# EAGLE design motor_encoder (EAGLE 9.6.2)
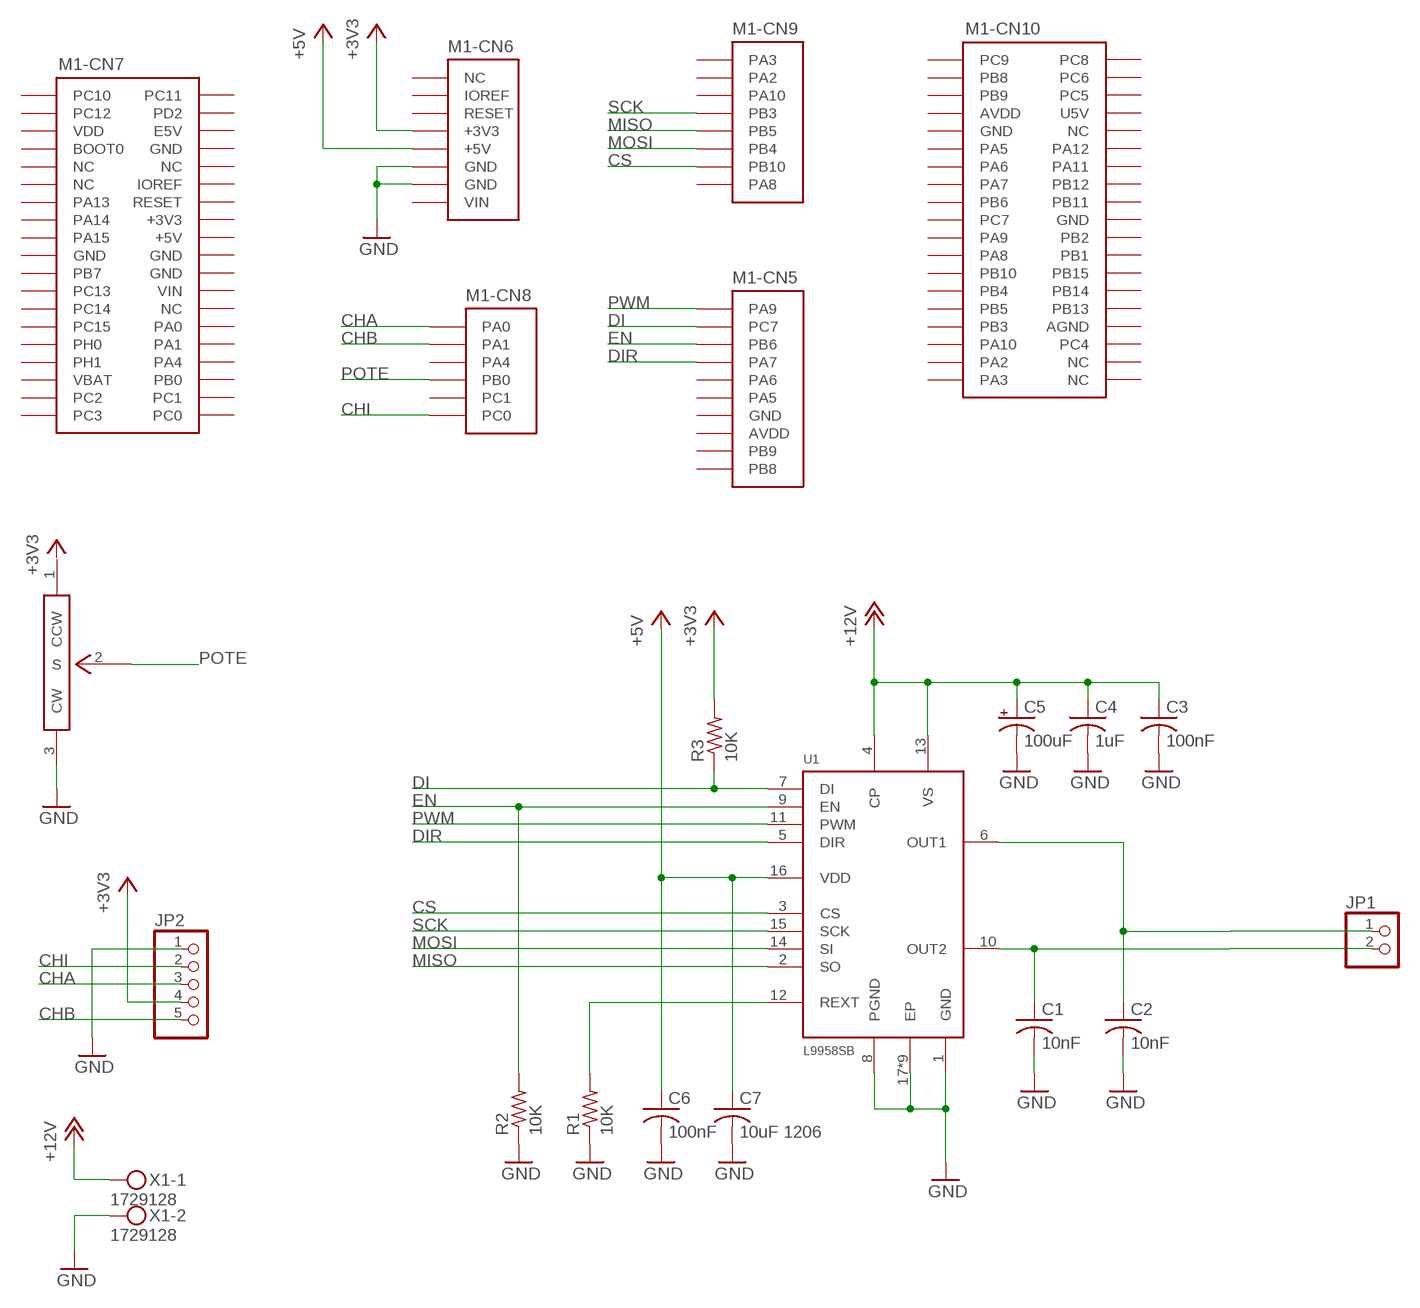
[diagram p0: schematic, sheet 1]

## Parts
C1  10nF  C-USC0805  [C0805]
C2  10nF  C-USC0805  [C0805]
C3  100nF  C-USC0805  [C0805]
C4  1uF  C-USC0805  [C0805]
C5  100uF  CPOL-US  [F80-UNITE_CHEMI-CON]
C6  100nF  C-USC0805  [C0805]
C7  10uF 1206  C-USC1206  [C1206]
JP1  PINHD-1X2  [1X02]
JP2  PINHD-1X5  [1X05]
M1  NUCLEO-L452RE  [NUCLEO-64]
R1  10K  R-US_R0805  [R0805]
R2  10K  R-US_R0805  [R0805]
R3  10K  R-US_R0805  [R0805]
U1  L9958SB  [POWERSO-16]
VR1  P160KN-0QD15B10K  P160KN  [P160KN-0QD15B10K]
X1  1729128  MKDSN1,5/2-5,08  [MKDSN1,5/2-5,08]

## Nets
+3V3: JP2.4 M1.CN6-4(-CN6:+3V3) R3.2
+5V: C6.1 C7.1 M1.CN6-5(-CN6:+5V) U1.16(VDD)
+12V: C3.1 C4.1 C5.1(+) U1.4(CP) U1.13(VS) X1.1
CHA: JP2.3 M1.CN8-1(-CN8:PA0)
CHB: JP2.5 M1.CN8-2(-CN8:PA1)
CHI: JP2.2 M1.CN8-6(-CN8:PC0)
CS: M1.CN9-7(-CN9:PB10) U1.3(CS)
DI: M1.CN5-2(-CN5:PC7) R3.1 U1.7(DI)
DIR: M1.CN5-4(-CN5:PA7) U1.5(DIR)
EN: M1.CN5-3(-CN5:PB6) R2.2 U1.9(EN)
GND: C1.2 C2.2 C3.2 C4.2 C5.2(-) C6.2 C7.2 JP2.1 M1.CN6-6(-CN6:GND) M1.CN6-7(-CN6:GND) R1.1 R2.1 U1.1(GND) U1.8(PGND) U1.17(EP) U1.18(EP) U1.19(EP) U1.20(EP) U1.21(EP) U1.22(EP) U1.23(EP) U1.24(EP) U1.25(EP) VR1.3(CW) X1.2
MISO: M1.CN9-5(-CN9:PB5) U1.2(SO)
MOSI: M1.CN9-6(-CN9:PB4) U1.14(SI)
N$1: C1.1 JP1.2 U1.10(OUT2)
N$2: C2.1 JP1.1 U1.6(OUT1)
N$3: R1.2 U1.12(REXT)
POTE: M1.CN8-4(-CN8:PB0) VR1.2(S)
PWM: M1.CN5-1(-CN5:PA9) U1.11(PWM)
SCK: M1.CN9-4(-CN9:PB3) U1.15(SCK)
Unconnected: M1.CN5-5(-CN5:PA6) M1.CN5-6(-CN5:PA5) M1.CN5-9(-CN5:PB9) M1.CN5-10(-CN5:PB8) M1.CN6-1(-CN6:NC) M1.CN6-3(-CN6:RESET) M1.CN7-1(-CN7:PC10) M1.CN7-2(-CN7:PC11) M1.CN7-3(-CN7:PC12) M1.CN7-4(-CN7:PD2) M1.CN7-6(-CN7:E5V) M1.CN7-7(-CN7:BOOT0) M1.CN7-9(-CN7:NC) M1.CN7-10(-CN7:NC) M1.CN7-11(-CN7:NC) M1.CN7-12(-CN7:IOREF) M1.CN7-13(-CN7:PA13) M1.CN7-14(-CN7:RESET) M1.CN7-15(-CN7:PA14) M1.CN7-17(-CN7:PA15) M1.CN7-21(-CN7:PB7) M1.CN7-23(-CN7:PC13) M1.CN7-25(-CN7:PC14) M1.CN7-26(-CN7:NC) M1.CN7-27(-CN7:PC15) M1.CN7-28(-CN7:PA0) M1.CN7-29(-CN7:PH0) M1.CN7-30(-CN7:PA1) M1.CN7-31(-CN7:PH1) M1.CN7-32(-CN7:PA4) M1.CN7-34(-CN7:PB0) M1.CN7-35(-CN7:PC2) M1.CN7-36(-CN7:PC1) M1.CN7-37(-CN7:PC3) M1.CN7-38(-CN7:PC0) M1.CN8-3(-CN8:PA4) M1.CN8-5(-CN8:PC1) M1.CN9-1(-CN9:PA3) M1.CN9-2(-CN9:PA2) M1.CN9-3(-CN9:PA10) M1.CN9-8(-CN9:PA8) M1.CN10-1(-CN10:PC9) M1.CN10-2(-CN10:PC8) M1.CN10-3(-CN10:PB8) M1.CN10-4(-CN10:PC6) M1.CN10-5(-CN10:PB9) M1.CN10-6(-CN10:PC5) M1.CN10-10(-CN10:NC) M1.CN10-11(-CN10:PA5) M1.CN10-12(-CN10:PA12) M1.CN10-13(-CN10:PA6) M1.CN10-14(-CN10:PA11) M1.CN10-15(-CN10:PA7) M1.CN10-16(-CN10:PB12) M1.CN10-17(-CN10:PB6) M1.CN10-18(-CN10:PB11) M1.CN10-19(-CN10:PC7) M1.CN10-21(-CN10:PA9) M1.CN10-22(-CN10:PB2) M1.CN10-23(-CN10:PA8) M1.CN10-24(-CN10:PB1) M1.CN10-25(-CN10:PB10) M1.CN10-26(-CN10:PB15) M1.CN10-27(-CN10:PB4) M1.CN10-28(-CN10:PB14) M1.CN10-29(-CN10:PB5) M1.CN10-30(-CN10:PB13) M1.CN10-31(-CN10:PB3) M1.CN10-33(-CN10:PA10) M1.CN10-34(-CN10:PC4) M1.CN10-35(-CN10:PA2) M1.CN10-36(-CN10:NC) M1.CN10-37(-CN10:PA3) M1.CN10-38(-CN10:NC) VR1.1(CCW)

## Power pins joined to a net without a drawn wire
+3V3: M1.CN7-16(-CN7:+3V3)
+5V: M1.CN7-18(-CN7:+5V)
AGND: M1.CN10-32(-CN10:AGND)
AVDD: M1.CN5-8(-CN5:AVDD) M1.CN10-7(-CN10:AVDD)
GND: M1.CN5-7(-CN5:GND) M1.CN7-8(-CN7:GND) M1.CN7-19(-CN7:GND) M1.CN7-20(-CN7:GND) M1.CN7-22(-CN7:GND) M1.CN10-9(-CN10:GND) M1.CN10-20(-CN10:GND)
IOREF: M1.CN6-2(-CN6:IOREF)
U5V: M1.CN10-8(-CN10:U5V)
VBAT: M1.CN7-33(-CN7:VBAT)
VDD: M1.CN7-5(-CN7:VDD)
VIN: M1.CN6-8(-CN6:VIN) M1.CN7-24(-CN7:VIN)

## Library data of the parts
C1 C2 = rcl:C-US: CAPACITOR, American symbol; PARTNO: GRM2195C1H103JA01D; SPICEPREFIX: C
C3 C6 = rcl:C-US: CAPACITOR, American symbol; PARTNO: GCM21BR72A104KA37L; SPICEPREFIX: C
C4 = rcl:C-US: CAPACITOR, American symbol; PARTNO: GCJ219R71C105KA01D; SPICEPREFIX: C
C5 = rcl_v2:CPOL-US: POLARIZED CAPACITOR, American symbol; PARTNO: EMVE250ADA101MF80G
C7 = rcl:C-US: CAPACITOR, American symbol; SPICEPREFIX: C
JP1 = pinhead:PINHD-1X2: PIN HEADER
JP2 = pinhead:PINHD-1X5: PIN HEADER
M1 = NUCLEO-L452RE:NUCLEO-L452RE: No existe un outline (Layer Dimension) para esta librería. En su lugar se utilizó una referencia en tDocu. Al momento de diseñar la tarjeta, el Dimension debe ser dibujado según los requerimientos del usuario, o simplemente copiar los contenidos del tDocu en Dimensions.
R1-R3 = rcl:R-US_: RESISTOR, American symbol; PARTNO: RC0805FR-0710KL; SPICEPREFIX: R
U1 = L9958SBTR:L9958SB; PARTNO: L9958SB
VR1 = P160KN:P160KN; PARTNO: P160KN-0QD15B10K
X1 = 1729128 - PHOENIX CONTACT:MKDSN1,5/2-5,08: MKDSN 1,5/ 2-5,08 Printklemme Nennstrom: 13,5 A Nennspannung: 250 V Rastermaß: 5,08 mm Polzahl: 2 Anschlussart: Schraubanschluss Montage: Löten Anschlussrichtung Leiter/Platine: 0 ° Artikelnummer: 1729128 Source: http://eshop.phoenixcontact.com .. 1729128.pdf; PARTNO: 1729128

## Board
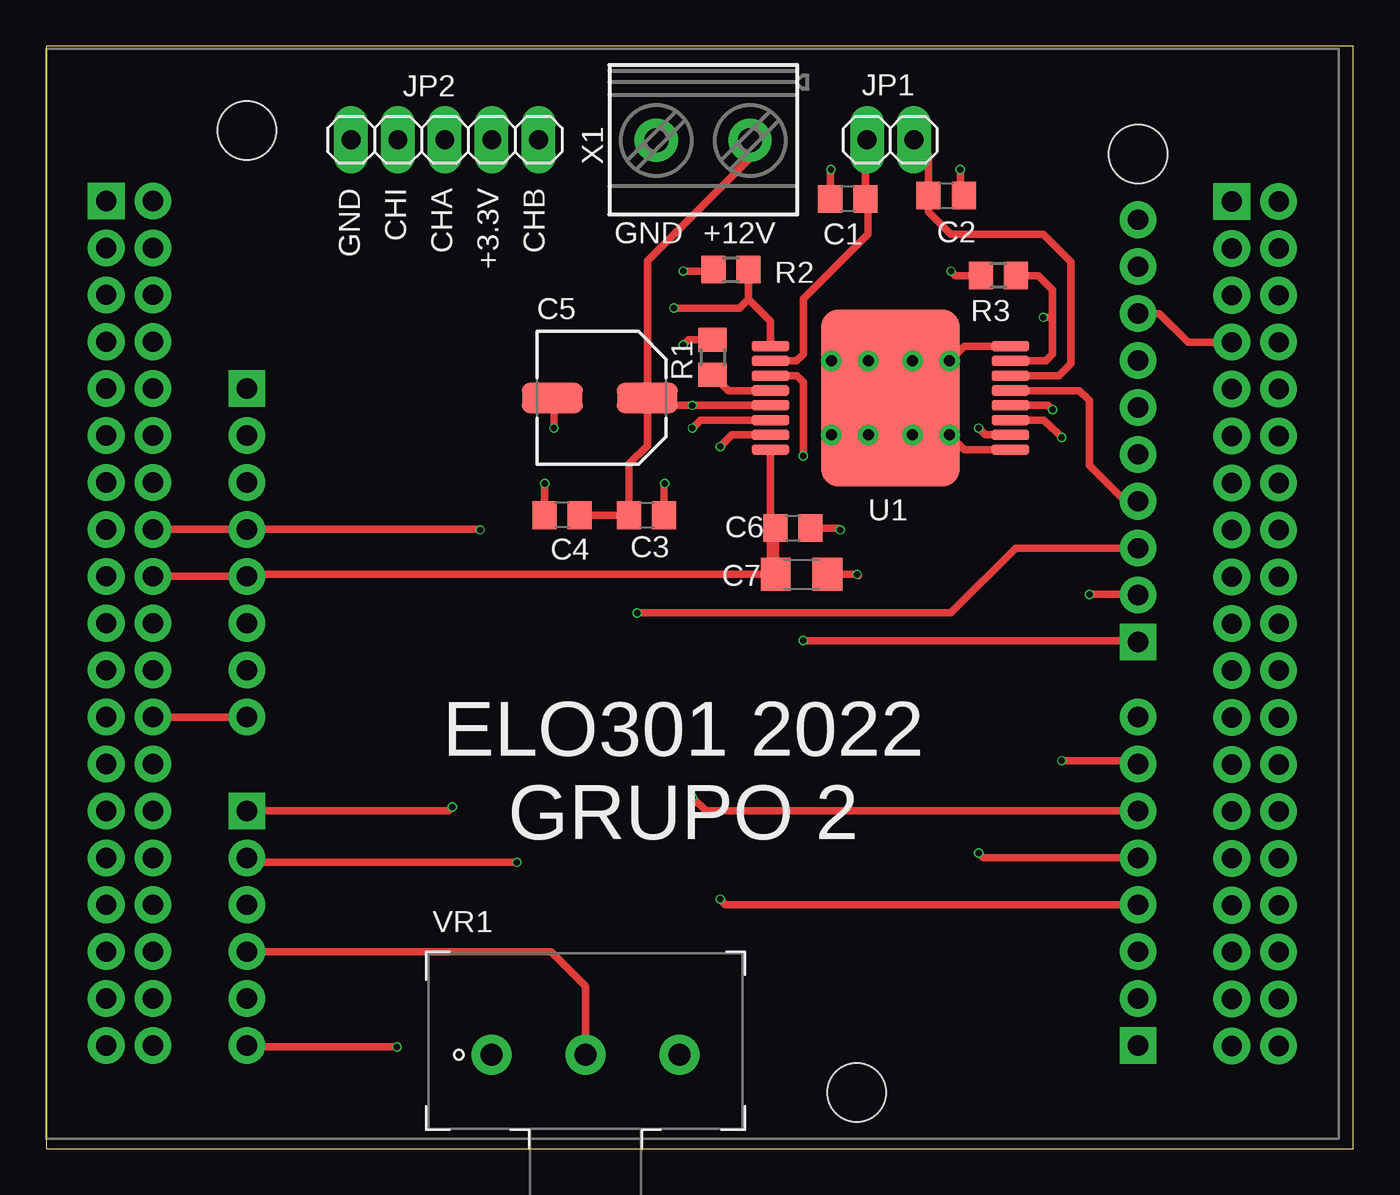
[diagram p1: board, top side]
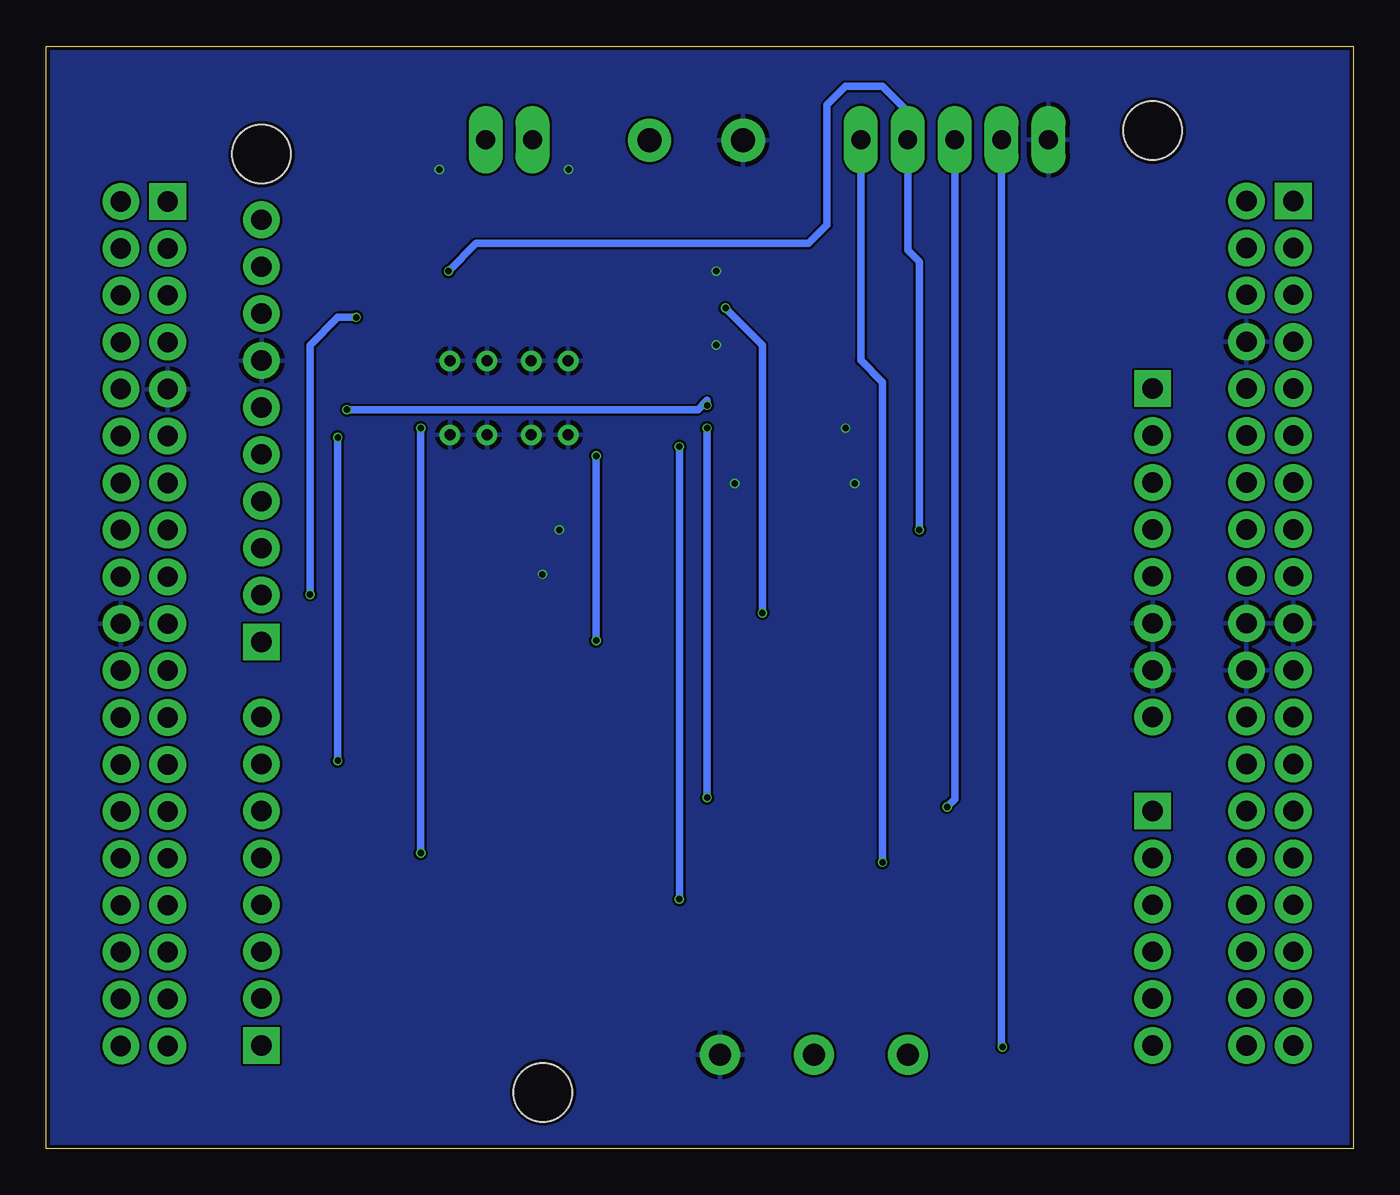
[diagram p2: board, bottom side, seen from below]

Size 70.79 x 59.68 mm. Coordinates in mm from the lower left corner, seen from the top.
Outline: 0,0 70.79,0 70.79,59.68 0,59.68 0,0
Copper layers (1*16): Top 0.035mm / dielectric 1.6mm / Bottom 0.035mm
Design rules "jlcpcb-2layers *": minimum track width 5mil, minimum drill 0.3mm, track to track 5mil, track to pad 5mil, pad to pad 5mil, via to via 5mil, smd to smd 5mil, copper to edge 0.2mm, drill to drill 6mil, minimum pad ring 10mil, minimum via ring 3mil, stop-mask expansion 4mil, vias tented up to drill 15mil, thermal gap 10mil

### Footprints (pad centres in the part's own frame; a part is rotated, then mirrored left to right if it is on the bottom)
C0805 = smd 1.3 x 1.5: 1 -0.95,0; 2 0.95,0
F80-UNITE_CHEMI-CON = smd 3.3 x 1.65: 1 -2.575,0; 2 2.575,0
C1206 = smd 1.6 x 1.8: 1 -1.4,0; 2 1.4,0
1X02 = drill 1.016 long: 1 -1.27,0; 2 1.27,0
1X05 = drill 1.016 long: 1 -5.08,0; 2 -2.54,0; 3 0,0; 4 2.54,0; 5 5.08,0
NUCLEO-64 = drill 1.1 pad 1.85 square: CN5-1 59.13,24.884; CN6-1 10.87,38.6; CN7-1 3.25,48.76; CN8-1 10.87,15.74; CN9-1 59.13,3.04; CN10-1 64.21,48.735 | drill 1.1 pad 1.85: CN5-2 59.13,27.424; CN5-3 59.13,29.964; CN5-4 59.13,32.504; CN5-5 59.13,35.044; CN5-6 59.13,37.584; CN5-7 59.13,40.124; CN5-8 59.13,42.664; CN5-9 59.13,45.204; CN5-10 59.13,47.744; CN6-2 10.87,36.06; CN6-3 10.87,33.52; CN6-4 10.87,30.98; CN6-5 10.87,28.44; CN6-6 10.87,25.9; CN6-7 10.87,23.36; CN6-8 10.87,20.82; CN7-2 5.79,48.76; CN7-3 3.25,46.22; CN7-4 5.79,46.22; CN7-5 3.25,43.68; CN7-6 5.79,43.68; CN7-7 3.25,41.14; CN7-8 5.79,41.14; CN7-9 3.25,38.6; CN7-10 5.79,38.6; CN7-11 3.25,36.06; CN7-12 5.79,36.06; CN7-13 3.25,33.52; CN7-14 5.79,33.52; CN7-15 3.25,30.98; CN7-16 5.79,30.98; CN7-17 3.25,28.44; CN7-18 5.79,28.44; CN7-19 3.25,25.9; CN7-20 5.79,25.9; CN7-21 3.25,23.36; CN7-22 5.79,23.36; CN7-23 3.25,20.82; CN7-24 5.79,20.82; CN7-25 3.25,18.28; CN7-26 5.79,18.28; CN7-27 3.25,15.74; CN7-28 5.79,15.74; CN7-29 3.25,13.2; CN7-30 5.79,13.2; CN7-31 3.25,10.66; CN7-32 5.79,10.66; CN7-33 3.25,8.12; CN7-34 5.79,8.12; CN7-35 3.25,5.58; CN7-36 5.79,5.58; CN7-37 3.25,3.04; CN7-38 5.79,3.04; CN8-2 10.87,13.2; CN8-3 10.87,10.66; CN8-4 10.87,8.12; CN8-5 10.87,5.58; CN8-6 10.87,3.04; CN9-2 59.13,5.58; CN9-3 59.13,8.12; CN9-4 59.13,10.66; CN9-5 59.13,13.2; CN9-6 59.13,15.74; CN9-7 59.13,18.28; CN9-8 59.13,20.82; CN10-2 66.75,48.735; CN10-3 64.21,46.195; CN10-4 66.75,46.195; CN10-5 64.21,43.655; CN10-6 66.75,43.655; CN10-7 64.21,41.115; CN10-8 66.75,41.115; CN10-9 64.21,38.575; CN10-10 66.75,38.575; CN10-11 64.21,36.035; CN10-12 66.75,36.035; CN10-13 64.21,33.495; CN10-14 66.75,33.495; CN10-15 64.21,30.955; CN10-16 66.75,30.955; CN10-17 64.21,28.415; CN10-18 66.75,28.415; CN10-19 64.21,25.875; CN10-20 66.75,25.875; CN10-21 64.21,23.335; CN10-22 66.75,23.335; CN10-23 64.21,20.795; CN10-24 66.75,20.795; CN10-25 64.21,18.255; CN10-26 66.75,18.255; CN10-27 64.21,15.715; CN10-28 66.75,15.715; CN10-29 64.21,13.175; CN10-30 66.75,13.175; CN10-31 64.21,10.635; CN10-32 66.75,10.635; CN10-33 64.21,8.095; CN10-34 66.75,8.095; CN10-35 64.21,5.555; CN10-36 66.75,5.555; CN10-37 64.21,3.015; CN10-38 66.75,3.015 | hole 3.175: 59.13,51.3; 10.87,52.57; 43.89,0.5
R0805 = smd 1.3 x 1.5: 1 -0.95,0; 2 0.95,0
POWERSO-16 = smd 2.05 x 0.55: 1 -6.5,2.8; 2 -6.5,2; 3 -6.5,1.2; 4 -6.5,0.4; 5 -6.5,-0.4; 6 -6.5,-1.2; 7 -6.5,-2; 8 -6.5,-2.8; 9 6.5,-2.8; 10 6.5,-2; 11 6.5,-1.2; 12 6.5,-0.4; 13 6.5,0.4; 14 6.5,1.2; 15 6.5,2; 16 6.5,2.8 | drill 0.6: 17 -1.2,2; 18 1.2,2; 19 1.2,-2; 20 -1.2,-2; 21 -3.2,-2; 22 3.2,-2; 23 3.2,2; 24 -3.2,2 | smd 7.5 x 9.6: 25 0,0
P160KN-0QD15B10K = drill 1.2: 1 0,-5.08; 2 0,0; 3 0,5.08
MKDSN1,5/2-5,08 = drill 1.3 pad 2: 1 -2.561,0.025; 2 2.519,0.025

### Placement (x,y rotation side)
C1  43.41,51.41 180 top
C2  48.74,51.59 0 top
C3  32.52,34.29 0 top
C4  27.94,34.29 180 top
C5  29.98,40.64 180 top
C6  40.44,33.59 0 top
C7  40.91,31.09 0 top
JP1  45.72,54.61 180 top
JP2  21.59,54.61 0 top
M1  0,2.54 0 top
R1  36.09,42.84 270 top
R2  37.08,47.59 0 top
R3  51.57,47.26 180 top
U1  45.72,40.64 180 top
VR1  29.21,5.08 270 top
X1  35.56,54.61 180 top

### Tracks (layer width: path | path; a pad name or v marks a point on that pad's centre or on a via)
+3V3  (via drill 0.35)
  Top 0.4: M1.CN7-16 M1.CN6-4 23.48,33.52 v23.5,33.5 | R3.2 49.24,47.26 v49,47.5
  Bottom 0.4: v23.5,33.5 23.5,48 24.13,48.63 24.13,54.5 JP2.4 24.13,56.13 25.5,57.5 27.5,57.5 28.5,56.5 28.5,50 29.5,49 47.5,49 v49,47.5
+5V
  Top 0.4: C7.1 39.22,31.38 U1.16 | C7.1 10.98,31.09 M1.CN6-5 M1.CN7-18 | C6.1 39.49,31.11 C7.1
+12V  (via drill 0.35)
  Top 0.4: U1.13 v35,40.24 32.95,40.24 C5.1 | C5.1 32.55,48.05 38.12,53.62 X1.1 | C4.1 C3.1 31.57,37.07 32.55,38.05 C5.1 | U1.4 54.26,40.24 v54.5,40
  Bottom 0.4: v54.5,40 35.5,40 35,40.5 v35,40.24
AVDD
  Top 0.4: M1.CN5-8 60.3,45.2 61.84,43.66 M1.CN10-7
CHA  (via drill 0.35)
  Top 0.4: v22,18.5 21.78,18.28 M1.CN8-1
  Bottom 0.4: JP2.3 21.59,18.91 v22,18.5
CHB  (via drill 0.35)
  Top 0.4: v25.5,15.5 11.11,15.5 M1.CN8-2
  Bottom 0.4: JP2.5 26.67,42.67 25.5,41.5 v25.5,15.5
CHI  (via drill 0.35)
  Top 0.4: v19,5.5 10.95,5.5 M1.CN8-6
  Bottom 0.4: JP2.2 19.05,5.55 v19,5.5
CS  (via drill 0.35)
  Top 0.4: U1.3 54.03,39.44 54.2,39.27 54.23,39.27 v55,38.5 | v55,21 58.95,21 M1.CN9-7
  Bottom 0.4: v55,38.5 v55,21
DI  (via drill 0.35)
  Top 0.4: U1.7 54.14,42.64 54.5,43 54.5,45 | R3.1 53.74,47.26 54.5,46.5 54.5,45 | 54.5,45 v54,45 | v56.5,30 59.09,30 M1.CN5-2
  Bottom 0.4: v54,45 55,45 56.5,43.5 v56.5,30
DIR
  Top 0.4: U1.5 55.96,41.04 56.5,40.5 56.5,37 58.46,35.04 M1.CN5-4
EN  (via drill 0.35)
  Top 0.4: U1.9 39.22,44.78 38.03,45.97 | 38.03,45.97 R2.2 | M1.CN5-3 52.5,32.5 49,29 v32,29 | v34,45.5 37.56,45.5 38.03,45.97
  Bottom 0.4: v32,29 32,43.5 v34,45.5
GND  (via drill 0.35)
  Top 0.4: C5.2 27.5,40.55 v27.5,39 | C4.2 v26.99,35.99 v27,36 | C3.2 33.47,35.97 v33.5,36 | C6.2 42.91,33.59 v43,33.5 | C7.2 v43.91,31.09 44,31 | R2.1 36.04,47.5 v34.5,47.5 | R1.1 34.79,43.79 v34.5,43.5 | U1.8 49.72,43.44 U1.21 | C1.2 42.46,52.96 v42.5,53 | C2.2 49.5,51.78 v49.5,53 | U1.1 49.72,37.84 U1.24 | U1.25 44.52,41.84 U1.19
  pour Bottom: 0,0 71,0 71,27.5 71,59.5 40,59.5 0,59.5
MISO  (via drill 0.35)
  Top 0.4: U1.2 50.86,38.64 v50.5,39 | v50.5,16 50.76,15.74 M1.CN9-5
  Bottom 0.4: v50.5,39 v50.5,16
MOSI  (via drill 0.35)
  Top 0.4: U1.14 35.44,39.44 v35,39 | v35,19 35.72,18.28 M1.CN9-6
  Bottom 0.4: v35,39 v35,19
N$1
  Top 0.4: U1.10 40.64,42.64 41,43 41,46 44.5,49.5 44.5,51.27 C1.1 44.36,54.52 JP1.2
N$2
  Top 0.4: JP1.1 47.79,53.81 C2.1 47.79,50.71 49,49.5 54,49.5 55.5,48 55.5,42.5 54.84,41.84 U1.6
N$3
  Top 0.4: U1.12 36.94,41.04 R1.2
POTE
  Top 0.4: M1.CN8-4 27.34,10.66 29.21,8.79 VR1.2
PWM  (via drill 0.35)
  Top 0.4: U1.11 40.66,41.84 41,41.5 v41,37.5 | v41,27.5 59.05,27.5 M1.CN5-1
  Bottom 0.4: v41,37.5 v41,27.5
SCK  (via drill 0.35)
  Top 0.4: U1.15 37.14,38.64 v36.5,38 | v36.5,13.5 36.8,13.2 M1.CN9-4
  Bottom 0.4: v36.5,38 v36.5,13.5
VIN
  Top 0.4: M1.CN7-24 M1.CN6-8

### Text on the board
tPlace: GND | CHI | CHA | +3.3V | CHB | GND | +12V
tNames: U1 | ELO301 2022 / GRUPO 2